# EAGLE schematic 8x8 LED Cathode Base V5 (EAGLE 6.1)
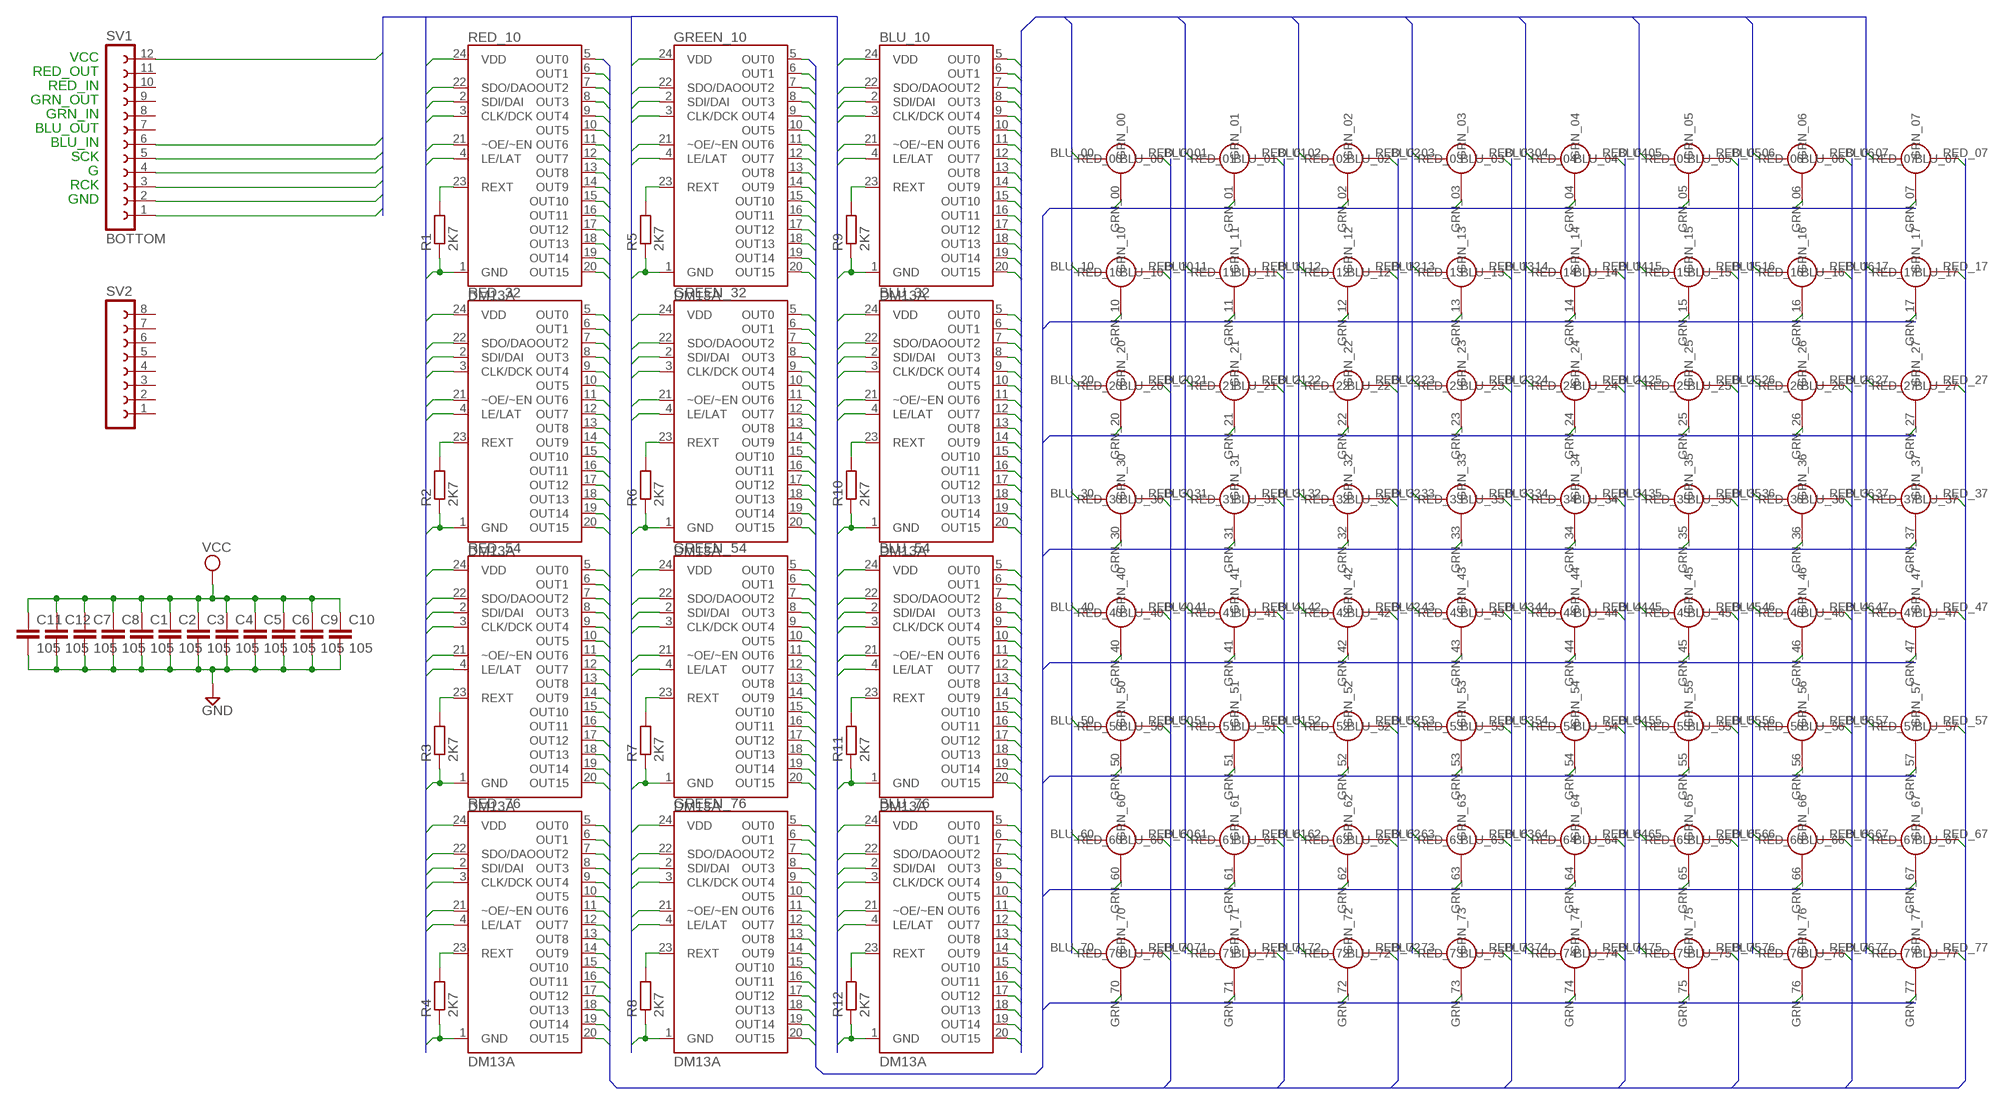
[diagram p0: schematic, sheet 1]

## Parts
BLU_10  DM13A  [DIL24-3]
BLU_32  DM13A  [DIL24-3]
BLU_54  DM13A  [DIL24-3]
BLU_76  DM13A  [DIL24-3]
C1  105  C-EUC1206  [C1206]
C2  105  C-EUC1206  [C1206]
C3  105  C-EUC1206  [C1206]
C4  105  C-EUC1206  [C1206]
C5  105  C-EUC1206  [C1206]
C6  105  C-EUC1206  [C1206]
C7  105  C-EUC1206  [C1206]
C8  105  C-EUC1206  [C1206]
C9  105  C-EUC1206  [C1206]
C10  105  C-EUC1206  [C1206]
C11  105  C-EUC1206  [C1206]
C12  105  C-EUC1206  [C1206]
GREEN_10  DM13A  [DIL24-3]
GREEN_32  DM13A  [DIL24-3]
GREEN_54  DM13A  [DIL24-3]
GREEN_76  DM13A  [DIL24-3]
R1  2K7  R-EU_R1206  [R1206]
R2  2K7  R-EU_R1206  [R1206]
R3  2K7  R-EU_R1206  [R1206]
R4  2K7  R-EU_R1206  [R1206]
R5  2K7  R-EU_R1206  [R1206]
R6  2K7  R-EU_R1206  [R1206]
R7  2K7  R-EU_R1206  [R1206]
R8  2K7  R-EU_R1206  [R1206]
R9  2K7  R-EU_R1206  [R1206]
R10  2K7  R-EU_R1206  [R1206]
R11  2K7  R-EU_R1206  [R1206]
R12  2K7  R-EU_R1206  [R1206]
RED_10  DM13A  [DIL24-3]
RED_32  DM13A  [DIL24-3]
RED_54  DM13A  [DIL24-3]
RED_76  DM13A  [DIL24-3]
SV1  BOTTOM  FE12-1  [FE12]
SV2  FE08-1  [FE08]
U$1  8X8_RGB_COLUMN  [8X8_RGB_LED_120]

## Nets
BLANK: BLU_10.21(~OE/~EN) BLU_32.21(~OE/~EN) BLU_54.21(~OE/~EN) BLU_76.21(~OE/~EN) GREEN_10.21(~OE/~EN) GREEN_32.21(~OE/~EN) GREEN_54.21(~OE/~EN) GREEN_76.21(~OE/~EN) RED_10.21(~OE/~EN) RED_32.21(~OE/~EN) RED_54.21(~OE/~EN) RED_76.21(~OE/~EN) SV1.4
BLU_00: BLU_10.5(OUT0) U$1.BLU_00
BLU_01: BLU_10.6(OUT1) U$1.BLU_01
BLU_02: BLU_10.7(OUT2) U$1.BLU_02
BLU_03: BLU_10.8(OUT3) U$1.BLU_03
BLU_04: BLU_10.9(OUT4) U$1.BLU_04
BLU_05: BLU_10.10(OUT5) U$1.BLU_05
BLU_06: BLU_10.11(OUT6) U$1.BLU_06
BLU_07: BLU_10.12(OUT7) U$1.BLU_07
BLU_10: BLU_10.13(OUT8) U$1.BLU_10
BLU_11: BLU_10.14(OUT9) U$1.BLU_11
BLU_12: BLU_10.15(OUT10) U$1.BLU_12
BLU_13: BLU_10.16(OUT11) U$1.BLU_13
BLU_14: BLU_10.17(OUT12) U$1.BLU_14
BLU_15: BLU_10.18(OUT13) U$1.BLU_15
BLU_16: BLU_10.19(OUT14) U$1.BLU_16
BLU_17: BLU_10.20(OUT15) U$1.BLU_17
BLU_20: BLU_32.5(OUT0) U$1.BLU_20
BLU_21: BLU_32.6(OUT1) U$1.BLU_21
BLU_22: BLU_32.7(OUT2) U$1.BLU_22
BLU_23: BLU_32.8(OUT3) U$1.BLU_23
BLU_24: BLU_32.9(OUT4) U$1.BLU_24
BLU_25: BLU_32.10(OUT5) U$1.BLU_25
BLU_26: BLU_32.11(OUT6) U$1.BLU_26
BLU_27: BLU_32.12(OUT7) U$1.BLU_27
BLU_30: BLU_32.13(OUT8) U$1.BLU_30
BLU_31: BLU_32.14(OUT9) U$1.BLU_31
BLU_32: BLU_32.15(OUT10) U$1.BLU_32
BLU_32_DATA: BLU_10.22(SDO/DAO) BLU_32.2(SDI/DAI)
BLU_33: BLU_32.16(OUT11) U$1.BLU_33
BLU_34: BLU_32.17(OUT12) U$1.BLU_34
BLU_35: BLU_32.18(OUT13) U$1.BLU_35
BLU_36: BLU_32.19(OUT14) U$1.BLU_36
BLU_37: BLU_32.20(OUT15) U$1.BLU_37
BLU_40: BLU_54.5(OUT0) U$1.BLU_40
BLU_41: BLU_54.6(OUT1) U$1.BLU_41
BLU_42: BLU_54.7(OUT2) U$1.BLU_42
BLU_43: BLU_54.8(OUT3) U$1.BLU_43
BLU_44: BLU_54.9(OUT4) U$1.BLU_44
BLU_45: BLU_54.10(OUT5) U$1.BLU_45
BLU_46: BLU_54.11(OUT6) U$1.BLU_46
BLU_47: BLU_54.12(OUT7) U$1.BLU_47
BLU_50: BLU_54.13(OUT8) U$1.BLU_50
BLU_51: BLU_54.14(OUT9) U$1.BLU_51
BLU_52: BLU_54.15(OUT10) U$1.BLU_52
BLU_53: BLU_54.16(OUT11) U$1.BLU_53
BLU_54: BLU_54.17(OUT12) U$1.BLU_54
BLU_54_DATA: BLU_32.22(SDO/DAO) BLU_54.2(SDI/DAI)
BLU_55: BLU_54.18(OUT13) U$1.BLU_55
BLU_56: BLU_54.19(OUT14) U$1.BLU_56
BLU_57: BLU_54.20(OUT15) U$1.BLU_57
BLU_60: BLU_76.5(OUT0) U$1.BLU_60
BLU_61: BLU_76.6(OUT1) U$1.BLU_61
BLU_62: BLU_76.7(OUT2) U$1.BLU_62
BLU_63: BLU_76.8(OUT3) U$1.BLU_63
BLU_64: BLU_76.9(OUT4) U$1.BLU_64
BLU_65: BLU_76.10(OUT5) U$1.BLU_65
BLU_66: BLU_76.11(OUT6) U$1.BLU_66
BLU_67: BLU_76.12(OUT7) U$1.BLU_67
BLU_70: BLU_76.13(OUT8) U$1.BLU_70
BLU_71: BLU_76.14(OUT9) U$1.BLU_71
BLU_72: BLU_76.15(OUT10) U$1.BLU_72
BLU_73: BLU_76.16(OUT11) U$1.BLU_73
BLU_74: BLU_76.17(OUT12) U$1.BLU_74
BLU_75: BLU_76.18(OUT13) U$1.BLU_75
BLU_76: BLU_76.19(OUT14) U$1.BLU_76
BLU_76_DATA: BLU_54.22(SDO/DAO) BLU_76.2(SDI/DAI)
BLU_77: BLU_76.20(OUT15) U$1.BLU_77
BLU_IN: BLU_10.2(SDI/DAI) SV1.6
BLU_OUT: BLU_76.22(SDO/DAO) GREEN_10.2(SDI/DAI)
CLOCK: BLU_10.3(CLK/DCK) BLU_32.3(CLK/DCK) BLU_54.3(CLK/DCK) BLU_76.3(CLK/DCK) GREEN_10.3(CLK/DCK) GREEN_32.3(CLK/DCK) GREEN_54.3(CLK/DCK) GREEN_76.3(CLK/DCK) RED_10.3(CLK/DCK) RED_32.3(CLK/DCK) RED_54.3(CLK/DCK) RED_76.3(CLK/DCK) SV1.5
GND: BLU_10.1(GND) BLU_32.1(GND) BLU_54.1(GND) BLU_76.1(GND) C1.2 C2.2 C3.2 C4.2 C5.2 C6.2 C7.2 C8.2 C9.2 C10.2 C11.2 C12.2 GREEN_10.1(GND) GREEN_32.1(GND) GREEN_54.1(GND) GREEN_76.1(GND) R1.1 R2.1 R3.1 R4.1 R5.1 R6.1 R7.1 R8.1 R9.1 R10.1 R11.1 R12.1 RED_10.1(GND) RED_32.1(GND) RED_54.1(GND) RED_76.1(GND) SV1.1 SV1.2
GRN_00: GREEN_10.5(OUT0) U$1.GRN_00
GRN_01: GREEN_10.6(OUT1) U$1.GRN_01
GRN_02: GREEN_10.7(OUT2) U$1.GRN_02
GRN_03: GREEN_10.8(OUT3) U$1.GRN_03
GRN_04: GREEN_10.9(OUT4) U$1.GRN_04
GRN_05: GREEN_10.10(OUT5) U$1.GRN_05
GRN_06: GREEN_10.11(OUT6) U$1.GRN_06
GRN_07: GREEN_10.12(OUT7) U$1.GRN_07
GRN_10: GREEN_10.13(OUT8) U$1.GRN_10
GRN_11: GREEN_10.14(OUT9) U$1.GRN_11
GRN_12: GREEN_10.15(OUT10) U$1.GRN_12
GRN_13: GREEN_10.16(OUT11) U$1.GRN_13
GRN_14: GREEN_10.17(OUT12) U$1.GRN_14
GRN_15: GREEN_10.18(OUT13) U$1.GRN_15
GRN_16: GREEN_10.19(OUT14) U$1.GRN_16
GRN_17: GREEN_10.20(OUT15) U$1.GRN_17
GRN_20: GREEN_32.5(OUT0) U$1.GRN_20
GRN_21: GREEN_32.6(OUT1) U$1.GRN_21
GRN_22: GREEN_32.7(OUT2) U$1.GRN_22
GRN_23: GREEN_32.8(OUT3) U$1.GRN_23
GRN_24: GREEN_32.9(OUT4) U$1.GRN_24
GRN_25: GREEN_32.10(OUT5) U$1.GRN_25
GRN_26: GREEN_32.11(OUT6) U$1.GRN_26
GRN_27: GREEN_32.12(OUT7) U$1.GRN_27
GRN_30: GREEN_32.13(OUT8) U$1.GRN_30
GRN_31: GREEN_32.14(OUT9) U$1.GRN_31
GRN_32: GREEN_32.15(OUT10) U$1.GRN_32
GRN_32_DATA: GREEN_10.22(SDO/DAO) GREEN_32.2(SDI/DAI)
GRN_33: GREEN_32.16(OUT11) U$1.GRN_33
GRN_34: GREEN_32.17(OUT12) U$1.GRN_34
GRN_35: GREEN_32.18(OUT13) U$1.GRN_35
GRN_36: GREEN_32.19(OUT14) U$1.GRN_36
GRN_37: GREEN_32.20(OUT15) U$1.GRN_37
GRN_40: GREEN_54.5(OUT0) U$1.GRN_40
GRN_41: GREEN_54.6(OUT1) U$1.GRN_41
GRN_42: GREEN_54.7(OUT2) U$1.GRN_42
GRN_43: GREEN_54.8(OUT3) U$1.GRN_43
GRN_44: GREEN_54.9(OUT4) U$1.GRN_44
GRN_45: GREEN_54.10(OUT5) U$1.GRN_45
GRN_46: GREEN_54.11(OUT6) U$1.GRN_46
GRN_47: GREEN_54.12(OUT7) U$1.GRN_47
GRN_50: GREEN_54.13(OUT8) U$1.GRN_50
GRN_51: GREEN_54.14(OUT9) U$1.GRN_51
GRN_52: GREEN_54.15(OUT10) U$1.GRN_52
GRN_53: GREEN_54.16(OUT11) U$1.GRN_53
GRN_54: GREEN_54.17(OUT12) U$1.GRN_54
GRN_54_DATA: GREEN_32.22(SDO/DAO) GREEN_54.2(SDI/DAI)
GRN_55: GREEN_54.18(OUT13) U$1.GRN_55
GRN_56: GREEN_54.19(OUT14) U$1.GRN_56
GRN_57: GREEN_54.20(OUT15) U$1.GRN_57
GRN_60: GREEN_76.5(OUT0) U$1.GRN_60
GRN_61: GREEN_76.6(OUT1) U$1.GRN_61
GRN_62: GREEN_76.7(OUT2) U$1.GRN_62
GRN_63: GREEN_76.8(OUT3) U$1.GRN_63
GRN_64: GREEN_76.9(OUT4) U$1.GRN_64
GRN_65: GREEN_76.10(OUT5) U$1.GRN_65
GRN_66: GREEN_76.11(OUT6) U$1.GRN_66
GRN_67: GREEN_76.12(OUT7) U$1.GRN_67
GRN_70: GREEN_76.13(OUT8) U$1.GRN_70
GRN_71: GREEN_76.14(OUT9) U$1.GRN_71
GRN_72: GREEN_76.15(OUT10) U$1.GRN_72
GRN_73: GREEN_76.16(OUT11) U$1.GRN_73
GRN_74: GREEN_76.17(OUT12) U$1.GRN_74
GRN_75: GREEN_76.18(OUT13) U$1.GRN_75
GRN_76: GREEN_76.19(OUT14) U$1.GRN_76
GRN_76_DATA: GREEN_54.22(SDO/DAO) GREEN_76.2(SDI/DAI)
GRN_77: GREEN_76.20(OUT15) U$1.GRN_77
GRN_OUT: GREEN_76.22(SDO/DAO) RED_10.2(SDI/DAI)
LATCH: BLU_10.4(LE/LAT) BLU_32.4(LE/LAT) BLU_54.4(LE/LAT) BLU_76.4(LE/LAT) GREEN_10.4(LE/LAT) GREEN_32.4(LE/LAT) GREEN_54.4(LE/LAT) GREEN_76.4(LE/LAT) RED_10.4(LE/LAT) RED_32.4(LE/LAT) RED_54.4(LE/LAT) RED_76.4(LE/LAT) SV1.3
N$1: GREEN_10.23(REXT) R5.2
N$3: GREEN_32.23(REXT) R6.2
N$4: GREEN_54.23(REXT) R7.2
N$5: GREEN_76.23(REXT) R8.2
N$6: BLU_10.23(REXT) R9.2
N$7: BLU_32.23(REXT) R10.2
N$8: BLU_54.23(REXT) R11.2
N$9: BLU_76.23(REXT) R12.2
N$13: R1.2 RED_10.23(REXT)
N$14: R2.2 RED_32.23(REXT)
N$15: R3.2 RED_54.23(REXT)
N$18: R4.2 RED_76.23(REXT)
RED_00: RED_10.5(OUT0) U$1.RED_00
RED_01: RED_10.6(OUT1) U$1.RED_01
RED_02: RED_10.7(OUT2) U$1.RED_02
RED_03: RED_10.8(OUT3) U$1.RED_03
RED_04: RED_10.9(OUT4) U$1.RED_04
RED_05: RED_10.10(OUT5) U$1.RED_05
RED_06: RED_10.11(OUT6) U$1.RED_06
RED_07: RED_10.12(OUT7) U$1.RED_07
RED_10: RED_10.13(OUT8) U$1.RED_10
RED_11: RED_10.14(OUT9) U$1.RED_11
RED_12: RED_10.15(OUT10) U$1.RED_12
RED_13: RED_10.16(OUT11) U$1.RED_13
RED_14: RED_10.17(OUT12) U$1.RED_14
RED_15: RED_10.18(OUT13) U$1.RED_15
RED_16: RED_10.19(OUT14) U$1.RED_16
RED_17: RED_10.20(OUT15) U$1.RED_17
RED_20: RED_32.5(OUT0) U$1.RED_20
RED_21: RED_32.6(OUT1) U$1.RED_21
RED_22: RED_32.7(OUT2) U$1.RED_22
RED_23: RED_32.8(OUT3) U$1.RED_23
RED_24: RED_32.9(OUT4) U$1.RED_24
RED_25: RED_32.10(OUT5) U$1.RED_25
RED_26: RED_32.11(OUT6) U$1.RED_26
RED_27: RED_32.12(OUT7) U$1.RED_27
RED_30: RED_32.13(OUT8) U$1.RED_30
RED_31: RED_32.14(OUT9) U$1.RED_31
RED_32: RED_32.15(OUT10) U$1.RED_32
RED_32_DATA: RED_10.22(SDO/DAO) RED_32.2(SDI/DAI)
RED_33: RED_32.16(OUT11) U$1.RED_33
RED_34: RED_32.17(OUT12) U$1.RED_34
RED_35: RED_32.18(OUT13) U$1.RED_35
RED_36: RED_32.19(OUT14) U$1.RED_36
RED_37: RED_32.20(OUT15) U$1.RED_37
RED_40: RED_54.5(OUT0) U$1.RED_40
RED_41: RED_54.6(OUT1) U$1.RED_41
RED_42: RED_54.7(OUT2) U$1.RED_42
RED_43: RED_54.8(OUT3) U$1.RED_43
RED_44: RED_54.9(OUT4) U$1.RED_44
RED_45: RED_54.10(OUT5) U$1.RED_45
RED_46: RED_54.11(OUT6) U$1.RED_46
RED_47: RED_54.12(OUT7) U$1.RED_47
RED_50: RED_54.13(OUT8) U$1.RED_50
RED_51: RED_54.14(OUT9) U$1.RED_51
RED_52: RED_54.15(OUT10) U$1.RED_52
RED_53: RED_54.16(OUT11) U$1.RED_53
RED_54: RED_54.17(OUT12) U$1.RED_54
RED_54_DATA: RED_32.22(SDO/DAO) RED_54.2(SDI/DAI)
RED_55: RED_54.18(OUT13) U$1.RED_55
RED_56: RED_54.19(OUT14) U$1.RED_56
RED_57: RED_54.20(OUT15) U$1.RED_57
RED_60: RED_76.5(OUT0) U$1.RED_60
RED_61: RED_76.6(OUT1) U$1.RED_61
RED_62: RED_76.7(OUT2) U$1.RED_62
RED_63: RED_76.8(OUT3) U$1.RED_63
RED_64: RED_76.9(OUT4) U$1.RED_64
RED_65: RED_76.10(OUT5) U$1.RED_65
RED_66: RED_76.11(OUT6) U$1.RED_66
RED_67: RED_76.12(OUT7) U$1.RED_67
RED_70: RED_76.13(OUT8) U$1.RED_70
RED_71: RED_76.14(OUT9) U$1.RED_71
RED_72: RED_76.15(OUT10) U$1.RED_72
RED_73: RED_76.16(OUT11) U$1.RED_73
RED_74: RED_76.17(OUT12) U$1.RED_74
RED_75: RED_76.18(OUT13) U$1.RED_75
RED_76: RED_76.19(OUT14) U$1.RED_76
RED_76_DATA: RED_54.22(SDO/DAO) RED_76.2(SDI/DAI)
RED_77: RED_76.20(OUT15) U$1.RED_77
RED_OUT: RED_76.22(SDO/DAO)
VCC: BLU_10.24(VDD) BLU_32.24(VDD) BLU_54.24(VDD) BLU_76.24(VDD) C1.1 C2.1 C3.1 C4.1 C5.1 C6.1 C7.1 C8.1 C9.1 C10.1 C11.1 C12.1 GREEN_10.24(VDD) GREEN_32.24(VDD) GREEN_54.24(VDD) GREEN_76.24(VDD) RED_10.24(VDD) RED_32.24(VDD) RED_54.24(VDD) RED_76.24(VDD) SV1.12
Unconnected: SV1.7 SV1.8 SV1.9 SV1.10 SV1.11 SV2.1 SV2.2 SV2.3 SV2.4 SV2.5 SV2.6 SV2.7 SV2.8

## Buses
RED
B$8
GREEN
BLUE

## Notes on the sheet
- VCC
- RED_OUT
- RED_IN
- GRN_OUT
- GRN_IN
- BLU_OUT
- BLU_IN
- SCK
- G
- RCK
- GND

## Library data of the parts
BLU_10 BLU_32 BLU_54 BLU_76 GREEN_10 GREEN_32 GREEN_54 GREEN_76 RED_10 RED_32 RED_54 RED_76 = 8x8x8_cube:DM13A: 16-Channel, Constant-Current LED Driver
C1-C12 = rcl:C-EU: CAPACITOR, European symbol
R1-R12 = resistor:R-EU_: RESISTOR, European symbol
SV1 = con-lsta:FE12-1: FEMALE HEADER; OC_FARNELL: unknown; OC_NEWARK: unknown
SV2 = con-lsta:FE08-1: FEMALE HEADER; OC_FARNELL: unknown; OC_NEWARK: unknown
U$1 = 8x8x8_cube:8X8_RGB_COLUMN: 8x8x8 RGB Cube Base Layout